# Altium schematic sheet 原理图.SchDoc: 辉光钟
size A3; Date: 2016/12/31; CheckedBy: dudu; Author: dudu; Time: 2016/12/31; DocumentName: 辉光钟原理图
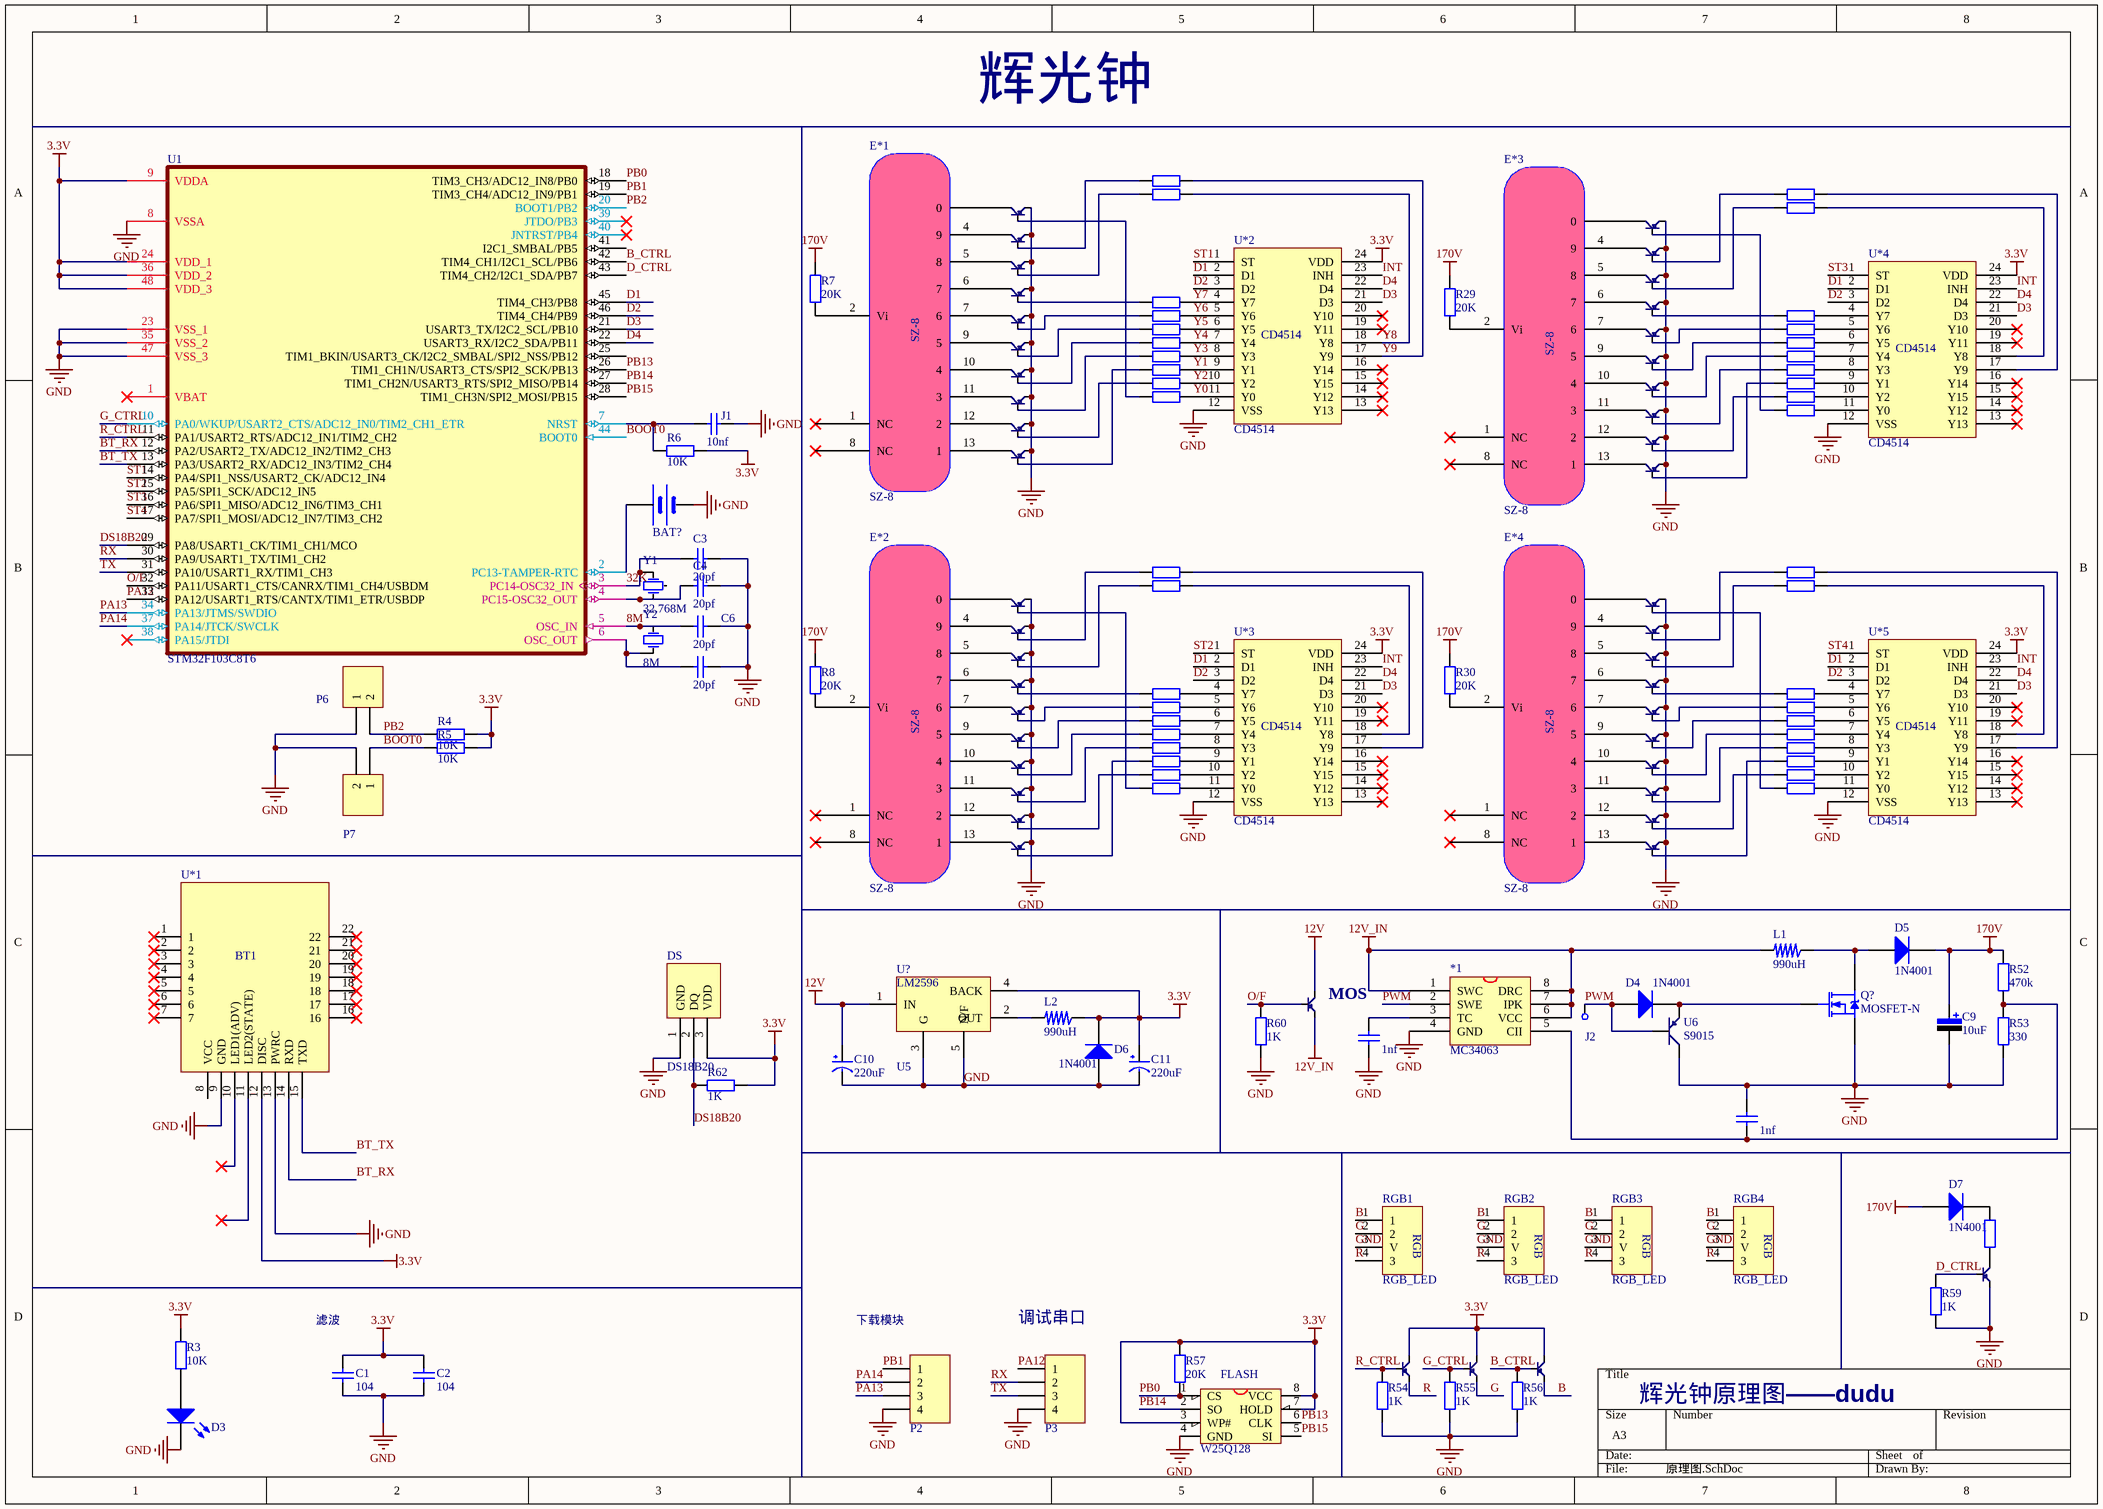
[diagram p0: 原理图.SchDoc]

## Parts
*1  MC34063  [SOP-8]
BAT?  BATT  [BAT]  (value not drawn)
C1  value 104  [C-RAD-0805]  (hidden comment: Cap)
C2  value 104  [C-RAD-0805]  (hidden comment: Cap)
C3  value 20pf  [C-RAD-0805]  (hidden comment: Cap)
C4  value 20pf  [C-RAD-0805]  (hidden comment: Cap)
C5  value 20pf  [C-RAD-0805]  (hidden comment: Cap)
C6  value 20pf  [C-RAD-0805]  (hidden comment: Cap)
C7  value 1nf  [C-RAD-0805]  (hidden comment: Cap)
C8  value 1nf  [C-RAD-0805]  (hidden comment: Cap)
C9  value 10uF  [CAP4]  (hidden comment: Cap Pol)
C10  220uF  [CAP7343]
C11  220uF  [CAP7343]
D3  LED0  [LED_0805]  (value not drawn)
D4  Type: 1N4001  [DIODE-SMA]  (hidden comment: Diode)
D5  Type: 1N4001  [DIODE-SMA]  (hidden comment: Diode)
D6  Type: 1N4001  [0805]  (hidden comment: Diode)
D7  Type: 1N4001  [0805]  (hidden comment: Diode)
DS  DS18B20  [TO-92A]
E*1  SZ-8  [SZ-8]
E*2  SZ-8  [SZ-8]
E*3  SZ-8  [SZ-8]
E*4  SZ-8  [SZ-8]
FLASH  W25Q128  [SOIC-8]
J1  value 10nf  [C-RAD-0805]  (hidden comment: Cap)
J2  CHECK  [CHECK-A]  (value not drawn)
L1  990uH  [L55]
L2  990uH  [L55]
NPN41  NPN_mini  [SOT-23r]  (value not drawn)
NPN42  NPN_mini  [SOT-23r]  (value not drawn)
NPN43  NPN_mini  [SOT-23r]  (value not drawn)
NPN44  NPN_mini  [SOT-23r]  (value not drawn)
NPN*1  NPN_mini  [SOT-23r]  (value not drawn)
NPN*2  NPN_mini  [SOT-23r]  (value not drawn)
NPN*3  NPN_mini  [SOT-23r]  (value not drawn)
NPN*4  NPN_mini  [SOT-23r]  (value not drawn)
NPN*5  NPN_mini  [SOT-23r]  (value not drawn)
NPN*6  NPN_mini  [SOT-23r]  (value not drawn)
NPN*7  NPN_mini  [SOT-23r]  (value not drawn)
NPN*8  NPN_mini  [SOT-23r]  (value not drawn)
NPN*9  NPN_mini  [SOT-23r]  (value not drawn)
NPN*10  NPN_mini  [SOT-23r]  (value not drawn)
NPN*11  NPN_mini  [SOT-23r]  (value not drawn)
NPN*12  NPN_mini  [SOT-23r]  (value not drawn)
NPN*13  NPN_mini  [SOT-23r]  (value not drawn)
NPN*14  NPN_mini  [SOT-23r]  (value not drawn)
NPN*15  NPN_mini  [SOT-23r]  (value not drawn)
NPN*16  NPN_mini  [SOT-23r]  (value not drawn)
NPN*17  NPN_mini  [SOT-23r]  (value not drawn)
NPN*18  NPN_mini  [SOT-23r]  (value not drawn)
NPN*19  NPN_mini  [SOT-23r]  (value not drawn)
NPN*20  NPN_mini  [SOT-23r]  (value not drawn)
NPN*21  NPN_mini  [SOT-23r]  (value not drawn)
NPN*22  NPN_mini  [SOT-23r]  (value not drawn)
NPN*23  NPN_mini  [SOT-23r]  (value not drawn)
NPN*24  NPN_mini  [SOT-23r]  (value not drawn)
NPN*25  NPN_mini  [SOT-23r]  (value not drawn)
NPN*26  NPN_mini  [SOT-23r]  (value not drawn)
NPN*27  NPN_mini  [SOT-23r]  (value not drawn)
NPN*28  NPN_mini  [SOT-23r]  (value not drawn)
NPN*29  NPN_mini  [SOT-23r]  (value not drawn)
NPN*30  NPN_mini  [SOT-23r]  (value not drawn)
NPN*31  NPN_mini  [SOT-23r]  (value not drawn)
NPN*32  NPN_mini  [SOT-23r]  (value not drawn)
NPN*33  NPN_mini  [SOT-23r]  (value not drawn)
NPN*34  NPN_mini  [SOT-23r]  (value not drawn)
NPN*35  NPN_mini  [SOT-23r]  (value not drawn)
NPN*36  NPN_mini  [SOT-23r]  (value not drawn)
NPN*37  NPN_mini  [SOT-23r]  (value not drawn)
NPN*38  NPN_mini  [SOT-23r]  (value not drawn)
NPN*39  NPN_mini  [SOT-23r]  (value not drawn)
NPN*40  NPN_mini  [SOT-23r]  (value not drawn)
NPN*41  NPN_mini  [SOT-23r]  (value not drawn)
P2  Header 4  [HDR4X1_A]  (value not drawn)
P3  Header 4  [HDR4X1_A]  (value not drawn)
P6  Header 2  [HDR2X1_A]  (value not drawn)
P7  Header 2  [HDR2X1_A]  (value not drawn)
Q?  MOSFET-N  [SOT263]
R3  value 10K  [0805-1]  (hidden comment: Res1)
R4  value 10K  [0805-1]  (hidden comment: Res1)
R5  value 10K  [0805-1]  (hidden comment: Res1)
R6  value 10K  [0805-1]  (hidden comment: Res1)
R7  value 20K  [0805-1]  (hidden comment: Res1)
R8  value 20K  [0805-1]  (hidden comment: Res1)
R9  Res1  [0805-1]  (value not drawn)
R10  Res1  [0805-1]  (value not drawn)
R11  Res1  [0805-1]  (value not drawn)
R12  Res1  [0805-1]  (value not drawn)
R13  Res1  [0805-1]  (value not drawn)
R14  Res1  [0805-1]  (value not drawn)
R15  Res1  [0805-1]  (value not drawn)
R16  Res1  [0805-1]  (value not drawn)
R17  Res1  [0805-1]  (value not drawn)
R18  Res1  [0805-1]  (value not drawn)
R19  Res1  [0805-1]  (value not drawn)
R20  Res1  [0805-1]  (value not drawn)
R21  Res1  [0805-1]  (value not drawn)
R22  Res1  [0805-1]  (value not drawn)
R23  Res1  [0805-1]  (value not drawn)
R24  Res1  [0805-1]  (value not drawn)
R25  Res1  [0805-1]  (value not drawn)
R26  Res1  [0805-1]  (value not drawn)
R27  Res1  [0805-1]  (value not drawn)
R28  Res1  [0805-1]  (value not drawn)
R29  value 20K  [0805-1]  (hidden comment: Res1)
R30  value 20K  [0805-1]  (hidden comment: Res1)
R32  Res1  [0805-1]  (value not drawn)
R33  Res1  [0805-1]  (value not drawn)
R34  Res1  [0805-1]  (value not drawn)
R35  Res1  [0805-1]  (value not drawn)
R36  Res1  [0805-1]  (value not drawn)
R37  Res1  [0805-1]  (value not drawn)
R38  Res1  [0805-1]  (value not drawn)
R39  Res1  [0805-1]  (value not drawn)
R40  Res1  [0805-1]  (value not drawn)
R41  Res1  [0805-1]  (value not drawn)
R42  Res1  [0805-1]  (value not drawn)
R43  Res1  [0805-1]  (value not drawn)
R44  Res1  [0805-1]  (value not drawn)
R45  Res1  [0805-1]  (value not drawn)
R46  Res1  [0805-1]  (value not drawn)
R47  Res1  [0805-1]  (value not drawn)
R48  Res1  [0805-1]  (value not drawn)
R49  Res1  [0805-1]  (value not drawn)
R50  Res1  [0805-1]  (value not drawn)
R51  Res1  [0805-1]  (value not drawn)
R52  value 470k  [0805-1]  (hidden comment: Res1)
R53  value 330  [0805-1]  (hidden comment: Res1)
R54  value 1K  [0805-1]  (hidden comment: Res1)
R55  value 1K  [0805-1]  (hidden comment: Res1)
R56  value 1K  [0805-1]  (hidden comment: Res1)
R57  value 20K  [0805-1]  (hidden comment: Res1)
R58  Res1  [0805-1]  (value not drawn)
R59  value 1K  [0805-1]  (hidden comment: Res1)
R60  value 1K  [0805-1]  (hidden comment: Res1)
R62  value 1K  [0805-1]  (hidden comment: Res1)
RGB1  RGB_LED  [RGB]
RGB2  RGB_LED  [RGB]
RGB3  RGB_LED  [RGB]
RGB4  RGB_LED  [RGB]
U1  STM32F103C8T6  [LQFP-48_M]
U6  S9015  [SOT-23r]
U*1  BT1  [BT1]
U*2  CD4514  [SOIC24]
U*3  CD4514  [SOIC24]
U*4  CD4514  [SOIC24]
U*5  CD4514  [SOIC24]
U?  U5  [TO263-5]
Y1  value 32.768M  [X-TC15]  (hidden comment: XTAL_SM)
Y2  value 8M  [5032]  (hidden comment: XTAL)

## Nets
3.3V: C1.2 C2.2 C11.1(VCC) D6.2(K) DS.3(VDD) FLASH.3(WP#) FLASH.7(HOLD) FLASH.8(VCC) L2.1 NPN41.3(C) NPN42.3(C) NPN43.3(C) R3.2 R4.2 R5.2 R6.2 R57.1 R62.2 U1.9(VDDA) U1.24(VDD_1) U1.36(VDD_2) U1.48(VDD_3) U*1.12(DISC) U*2.24(VDD) U*3.24(VDD) U*4.24(VDD) U*5.24(VDD) U?.4(BACK)
12V: C10.1(VCC) NPN*41.3(C) U?.1(IN)
12V_IN: *1.1(SWC) *1.6(VCC) *1.7(IPK) *1.8(DRC) L1.2 NPN*41.2(E)
170V: C9.1 D5.2(K) D7.1(A) R7.2 R8.2 R29.2 R30.2 R52.1
GND: *1.4(GND) BAT?.2(GND) C1.1 C2.1 C3.1 C4.1 C5.1 C6.1 C7.2 C8.1 C9.2 C10.2(GND) C11.2(GND) D3.2(K) D6.1(A) DS.1(GND) FLASH.4(GND) J1.1 NPN44.2(E) NPN*1.2(E) NPN*2.2(E) NPN*3.2(E) NPN*4.2(E) NPN*5.2(E) NPN*6.2(E) NPN*7.2(E) NPN*8.2(E) NPN*9.2(E) NPN*10.2(E) NPN*11.2(E) NPN*12.2(E) NPN*13.2(E) NPN*14.2(E) NPN*15.2(E) NPN*16.2(E) NPN*17.2(E) NPN*18.2(E) NPN*19.2(E) NPN*20.2(E) NPN*21.2(E) NPN*22.2(E) NPN*23.2(E) NPN*24.2(E) NPN*25.2(E) NPN*26.2(E) NPN*27.2(E) NPN*28.2(E) NPN*29.2(E) NPN*30.2(E) NPN*31.2(E) NPN*32.2(E) NPN*33.2(E) NPN*34.2(E) NPN*35.2(E) NPN*36.2(E) NPN*37.2(E) NPN*38.2(E) NPN*39.2(E) NPN*40.2(E) P2.4 P3.4 P6.1 P7.2 Q?.S R53.2 R54.2 R55.2 R56.2 R59.2 R60.2 RGB1.3(V) RGB2.3(V) RGB3.3(V) RGB4.3(V) U1.8(VSSA) U1.23(VSS_1) U1.35(VSS_2) U1.47(VSS_3) U6.3(C) U*1.9(GND) U*1.13(PWRC) U*2.12(VSS) U*3.12(VSS) U*4.12(VSS) U*5.12(VSS) U?.3(G) U?.5(N/F)
8M: C6.2 U1.5(OSC_IN) Y2.1(OSC1)
32K: C3.2 U1.3(PC14-OSC32_IN) Y1.2(OSC2)
B: NPN43.2(E) RGB1.1 RGB2.1 RGB3.1 RGB4.1
B_CTRL: NPN43.1(B) R56.1 U1.42(TIM4_CH1/I2C1_SCL/PB6)
BOOT0: P7.1 R5.1 U1.44(BOOT0)
BT_RX: U1.12(PA2/USART2_TX/ADC12_IN2/TIM2_CH3) U*1.14(RXD)
BT_TX: U1.13(PA3/USART2_RX/ADC12_IN3/TIM2_CH4) U*1.15(TXD)
D1: U1.45(TIM4_CH3/PB8) U*2.2(D1) U*3.2(D1) U*4.2(D1) U*5.2(D1)
D2: U1.46(TIM4_CH4/PB9) U*2.3(D2) U*3.3(D2) U*4.3(D2) U*5.3(D2)
D3: U1.21(USART3_TX/I2C2_SCL/PB10) U*2.21(D3) U*3.21(D3) U*4.21(D3) U*5.21(D3)
D4: U1.22(USART3_RX/I2C2_SDA/PB11) U*2.22(D4) U*3.22(D4) U*4.22(D4) U*5.22(D4)
D_CTRL: NPN44.1(B) R59.1 U1.43(TIM4_CH2/I2C1_SDA/PB7)
DS18B20: DS.2(DQ) R62.1 U1.29(PA8/USART1_CK/TIM1_CH1/MCO)
G: NPN42.2(E) RGB1.2 RGB2.2 RGB3.2 RGB4.2
G_CTRL: NPN42.1(B) R55.1 U1.10(PA0/WKUP/USART2_CTS/ADC12_IN0/TIM2_CH1_ETR)
INT: U*2.23(INH) U*3.23(INH) U*4.23(INH) U*5.23(INH)
O/F: NPN*41.1(B) R60.1 U1.32(PA11/USART1_CTS/CANRX/TIM1_CH4/USBDM)
PA12: P3.1 U1.33(PA12/USART1_RTS/CANTX/TIM1_ETR/USBDP)
PA13: P2.3 U1.34(PA13/JTMS/SWDIO)
PA14: P2.2 U1.37(PA14/JTCK/SWCLK)
PB0: FLASH.1(CS) R57.2 U1.18(TIM3_CH3/ADC12_IN8/PB0)
PB1: P2.1 U1.19(TIM3_CH4/ADC12_IN9/PB1)
PB2: P6.2 R4.1 U1.20(BOOT1/PB2)
PB13: FLASH.6(CLK) U1.26(TIM1_CH1N/USART3_CTS/SPI2_SCK/PB13)
PB14: FLASH.2(SO) U1.27(TIM1_CH2N/USART3_RTS/SPI2_MISO/PB14)
PB15: FLASH.5(SI) U1.28(TIM1_CH3N/SPI2_MOSI/PB15)
PWM: *1.2(SWE) D4.1(A) J2.1 U6.1(B)
R: NPN41.2(E) RGB1.4(3) RGB2.4(3) RGB3.4(3) RGB4.4(3)
R_CTRL: NPN41.1(B) R54.1 U1.11(PA1/USART2_RTS/ADC12_IN1/TIM2_CH2)
RX: P3.2 U1.30(PA9/USART1_TX/TIM1_CH2)
ST1: U1.14(PA4/SPI1_NSS/USART2_CK/ADC12_IN4) U*2.1(ST)
ST2: U1.15(PA5/SPI1_SCK/ADC12_IN5) U*3.1(ST)
ST3: U1.16(PA6/SPI1_MISO/ADC12_IN6/TIM3_CH1) U*4.1(ST)
ST4: U1.17(PA7/SPI1_MOSI/ADC12_IN7/TIM3_CH2) U*5.1(ST)
TX: P3.3 U1.31(PA10/USART1_RX/TIM1_CH3)
Y0: R18.1 U*2.11(Y0)
Y1: R16.1 U*2.9(Y1)
Y2: R17.1 U*2.10(Y2)
Y3: R15.1 U*2.8(Y3)
Y4: R14.1 U*2.7(Y4)
Y5: R13.1 U*2.6(Y5)
Y6: R12.1 U*2.5(Y6)
Y7: R11.1 U*2.4(Y7)
Y8: R10.1 U*2.18(Y8)
Y9: R9.1 U*2.17(Y9)
Net*1_3: *1.3(TC) C7.1
Net*1_5: *1.5(CII) C8.2 R52.2 R53.1
NetBAT?_1: BAT?.1(VCC) U1.2(PC13-TAMPER-RTC)
NetC4_2: C4.2 U1.4(PC15-OSC32_OUT) Y1.1(OSC1)
NetC5_2: C5.2 U1.6(OSC_OUT) Y2.2(OSC2)
NetD3_1: D3.1(A) R3.1
NetD4_2: D4.2(K) Q?.G U6.2(E)
NetD5_1: D5.1(A) L1.1 Q?.D
NetD7_2: D7.2(K) R58.1
NetE*1_2: E*1.2(Vi) R7.1
NetE*1_3: E*1.3(0) NPN*1.3(C)
NetE*1_4: E*1.4(9) NPN*2.3(C)
NetE*1_5: E*1.5(8) NPN*3.3(C)
NetE*1_6: E*1.6(7) NPN*4.3(C)
NetE*1_7: E*1.7(6) NPN*5.3(C)
NetE*1_9: E*1.9(5) NPN*6.3(C)
NetE*1_10: E*1.10(4) NPN*7.3(C)
NetE*1_11: E*1.11(3) NPN*8.3(C)
NetE*1_12: E*1.12(2) NPN*9.3(C)
NetE*1_13: E*1.13(1) NPN*10.3(C)
NetE*2_2: E*2.2(Vi) R8.1
NetE*2_3: E*2.3(0) NPN*11.3(C)
NetE*2_4: E*2.4(9) NPN*12.3(C)
NetE*2_5: E*2.5(8) NPN*13.3(C)
NetE*2_6: E*2.6(7) NPN*14.3(C)
NetE*2_7: E*2.7(6) NPN*15.3(C)
NetE*2_9: E*2.9(5) NPN*16.3(C)
NetE*2_10: E*2.10(4) NPN*17.3(C)
NetE*2_11: E*2.11(3) NPN*18.3(C)
NetE*2_12: E*2.12(2) NPN*19.3(C)
NetE*2_13: E*2.13(1) NPN*20.3(C)
NetE*3_2: E*3.2(Vi) R29.1
NetE*3_3: E*3.3(0) NPN*21.3(C)
NetE*3_4: E*3.4(9) NPN*22.3(C)
NetE*3_5: E*3.5(8) NPN*23.3(C)
NetE*3_6: E*3.6(7) NPN*24.3(C)
NetE*3_7: E*3.7(6) NPN*25.3(C)
NetE*3_9: E*3.9(5) NPN*26.3(C)
NetE*3_10: E*3.10(4) NPN*27.3(C)
NetE*3_11: E*3.11(3) NPN*28.3(C)
NetE*3_12: E*3.12(2) NPN*29.3(C)
NetE*3_13: E*3.13(1) NPN*30.3(C)
NetE*4_2: E*4.2(Vi) R30.1
NetE*4_3: E*4.3(0) NPN*31.3(C)
NetE*4_4: E*4.4(9) NPN*32.3(C)
NetE*4_5: E*4.5(8) NPN*33.3(C)
NetE*4_6: E*4.6(7) NPN*34.3(C)
NetE*4_7: E*4.7(6) NPN*35.3(C)
NetE*4_9: E*4.9(5) NPN*36.3(C)
NetE*4_10: E*4.10(4) NPN*37.3(C)
NetE*4_11: E*4.11(3) NPN*38.3(C)
NetE*4_12: E*4.12(2) NPN*39.3(C)
NetE*4_13: E*4.13(1) NPN*40.3(C)
NetJ1_2: J1.2 R6.1 U1.7(NRST)
NetL2_2: L2.2 U?.2(OUT)
NetNPN44_3: NPN44.3(C) R58.2
NetNPN*1_1: NPN*1.1(B) R18.2
NetNPN*2_1: NPN*2.1(B) R9.2
NetNPN*3_1: NPN*3.1(B) R10.2
NetNPN*4_1: NPN*4.1(B) R11.2
NetNPN*5_1: NPN*5.1(B) R12.2
NetNPN*6_1: NPN*6.1(B) R13.2
NetNPN*7_1: NPN*7.1(B) R14.2
NetNPN*8_1: NPN*8.1(B) R15.2
NetNPN*9_1: NPN*9.1(B) R17.2
NetNPN*10_1: NPN*10.1(B) R16.2
NetNPN*11_1: NPN*11.1(B) R28.2
NetNPN*12_1: NPN*12.1(B) R19.2
NetNPN*13_1: NPN*13.1(B) R20.2
NetNPN*14_1: NPN*14.1(B) R21.2
NetNPN*15_1: NPN*15.1(B) R22.2
NetNPN*16_1: NPN*16.1(B) R23.2
NetNPN*17_1: NPN*17.1(B) R24.2
NetNPN*18_1: NPN*18.1(B) R25.2
NetNPN*19_1: NPN*19.1(B) R27.2
NetNPN*20_1: NPN*20.1(B) R26.2
NetNPN*21_1: NPN*21.1(B) R41.2
NetNPN*22_1: NPN*22.1(B) R32.2
NetNPN*23_1: NPN*23.1(B) R33.2
NetNPN*24_1: NPN*24.1(B) R34.2
NetNPN*25_1: NPN*25.1(B) R35.2
NetNPN*26_1: NPN*26.1(B) R36.2
NetNPN*27_1: NPN*27.1(B) R37.2
NetNPN*28_1: NPN*28.1(B) R38.2
NetNPN*29_1: NPN*29.1(B) R40.2
NetNPN*30_1: NPN*30.1(B) R39.2
NetNPN*31_1: NPN*31.1(B) R51.2
NetNPN*32_1: NPN*32.1(B) R42.2
NetNPN*33_1: NPN*33.1(B) R43.2
NetNPN*34_1: NPN*34.1(B) R44.2
NetNPN*35_1: NPN*35.1(B) R45.2
NetNPN*36_1: NPN*36.1(B) R46.2
NetNPN*37_1: NPN*37.1(B) R47.2
NetNPN*38_1: NPN*38.1(B) R48.2
NetNPN*39_1: NPN*39.1(B) R50.2
NetNPN*40_1: NPN*40.1(B) R49.2
NetR19_1: R19.1 U*3.17(Y9)
NetR20_1: R20.1 U*3.18(Y8)
NetR21_1: R21.1 U*3.4(Y7)
NetR22_1: R22.1 U*3.5(Y6)
NetR23_1: R23.1 U*3.6(Y5)
NetR24_1: R24.1 U*3.7(Y4)
NetR25_1: R25.1 U*3.8(Y3)
NetR26_1: R26.1 U*3.9(Y1)
NetR27_1: R27.1 U*3.10(Y2)
NetR28_1: R28.1 U*3.11(Y0)
NetR32_1: R32.1 U*4.17(Y9)
NetR33_1: R33.1 U*4.18(Y8)
NetR34_1: R34.1 U*4.4(Y7)
NetR35_1: R35.1 U*4.5(Y6)
NetR36_1: R36.1 U*4.6(Y5)
NetR37_1: R37.1 U*4.7(Y4)
NetR38_1: R38.1 U*4.8(Y3)
NetR39_1: R39.1 U*4.9(Y1)
NetR40_1: R40.1 U*4.10(Y2)
NetR41_1: R41.1 U*4.11(Y0)
NetR42_1: R42.1 U*5.17(Y9)
NetR43_1: R43.1 U*5.18(Y8)
NetR44_1: R44.1 U*5.4(Y7)
NetR45_1: R45.1 U*5.5(Y6)
NetR46_1: R46.1 U*5.6(Y5)
NetR47_1: R47.1 U*5.7(Y4)
NetR48_1: R48.1 U*5.8(Y3)
NetR49_1: R49.1 U*5.9(Y1)
NetR50_1: R50.1 U*5.10(Y2)
NetR51_1: R51.1 U*5.11(Y0)

Not connected (* = marked no-connect by the designer): E*1 1(NC)* 8(NC)*; E*2 1(NC)* 8(NC)*; E*3 1(NC)* 8(NC)*; E*4 1(NC)* 8(NC)*; U1 1(VBAT)* 25(TIM1_BKIN/USART3_CK/I2C2_SMBAL/SPI2_NSS/PB12) 38(PA15/JTDI)* 39(JTDO/PB3)* 40(JNTRST/PB4)* 41(I2C1_SMBAL/PB5); U*1 1* 2* 3* 4* 5* 6* 7* 8(VCC) 10(LED1(ADV))* 11(LED2(STATE))* 16* 17* 18* 19* 20* 21* 22*; U*2 13(Y13)* 14(Y12)* 15(Y15)* 16(Y14)* 19(Y11)* 20(Y10)*; U*3 13(Y13)* 14(Y12)* 15(Y15)* 16(Y14)* 19(Y11)* 20(Y10)*; U*4 13(Y13)* 14(Y12)* 15(Y15)* 16(Y14)* 19(Y11)* 20(Y10)*; U*5 13(Y13)* 14(Y12)* 15(Y15)* 16(Y14)* 19(Y11)* 20(Y10)*; Y1 3

## Notes on the sheet
- 辉光钟
- (near NPN*41) MOS
- (near C1) 滤波
- (near P2) 下载模块
- (near P3) 调试串口
- 辉光钟原理图——dudu
- (in symbol RGB_LED) RGB

## Library data of the parts
BAT? = BAT
C1-C8 J1 = Cap: 无极性电容; Published: 8-Jun-2000; LatestRevisionDate: 17-Jul-2002; LatestRevisionNote: Re-released for DXP Platform.; PackageReference: RAD-0.3; Publisher: Altium Limited
C9 = Cap Pol: 极性电解电容; Vol: 16V; Published: 8-Jun-2000; LatestRevisionDate: 17-Jul-2002; LatestRevisionNote: Re-released for DXP Platform.; PackageReference: RB7.6-15; Publisher: Altium Limited
C10 C11 = CAP
D3 = LED0: 发光二极管; Published: 8-Jun-2000; LatestRevisionDate: 08-Jul-2005; LatestRevisionNote: Mech Layer 1 removed.; PackageReference: LED-0; Publisher: Altium Limited
D4-D7 = Diode: 二极管; Published: 8-Jun-2000; LatestRevisionDate: 17-Jul-2002; LatestRevisionNote: Re-released for DXP Platform.; PackageDocument: Sep-1996; PackageReference: SMC; Publisher: Altium Limited; Code_JEDEC: DO-214-AB
DS = DS18B20: 温度传感器
FLASH = W25X16: W25X16;SST25VF016;MX25L1605
J2 = CHECK: 测试点
L1 L2 = L_SOP
P2 P3 = Header 4: 接插件; LatestRevisionDate: 17-Jul-2002; LatestRevisionNote: Re-released for DXP Platform.; Publisher: Altium Limited
P6 P7 = Header 2: 接插件; LatestRevisionDate: 17-Jul-2002; LatestRevisionNote: Re-released for DXP Platform.; Publisher: Altium Limited
Q? = MOSFET-N: N-Channel MOSFET; PackageDocument: 1995/1996; Published: 8-Jun-2000; LatestRevisionDate: 17-Jul-2002; LatestRevisionNote: Re-released for DXP Platform.; PackageReference: E3; Publisher: Altium Limited
R3-R8 R29 R30 R52-R57 R59 R60 R62 = Res1: 贴片电阻; Published: 8-Jun-2000; LatestRevisionDate: 17-Jul-2002; LatestRevisionNote: Re-released for DXP Platform.; PackageReference: AXIAL-0.4; Publisher: Altium Limited
R9-R28 R32-R51 R58 = Res1: 贴片电阻; Value: 20K; Published: 8-Jun-2000; LatestRevisionDate: 17-Jul-2002; LatestRevisionNote: Re-released for DXP Platform.; PackageReference: AXIAL-0.4; Publisher: Altium Limited
U1 = STM32F103C8T6: STM32 ARM-based 32-bit MCU with 64 Kbytes Flash, 48-pin LQFP, Industrial Temperature; Published: *; DatasheetVersion: *; PackageVersion: *; PackageReference: *; Publisher: *; PackageDescription: *; ComponentLink1Description: *; ComponentLink1URL: *; ComponentLink2Description: *; ComponentLink2URL: *
U? = LM2596
Y1 = XTAL_SM: 圆柱晶振; Published: 8-Jun-2000; LatestRevisionDate: 17-Jul-2002; LatestRevisionNote: Re-released for DXP Platform.; PackageReference: R38; Publisher: Altium Limited
Y2 = XTAL: 晶振; Published: 8-Jun-2000; LatestRevisionDate: 17-Jul-2002; LatestRevisionNote: Re-released for DXP Platform.; PackageReference: R38; Publisher: Altium Limited